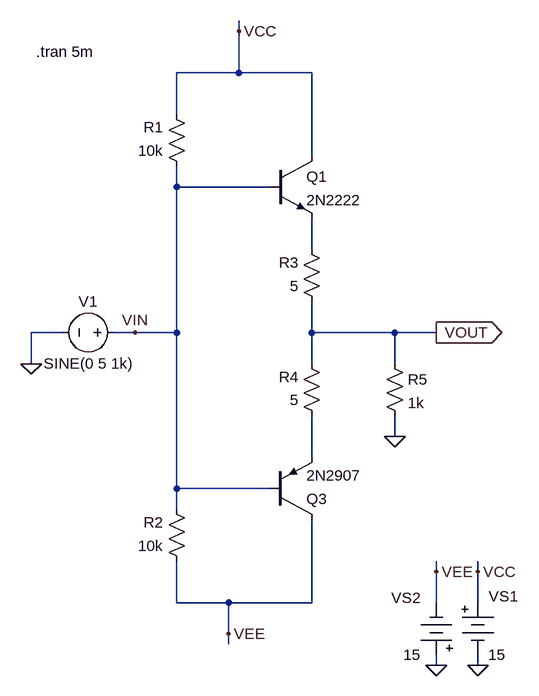
[diagram p0: schematic fig-02-06-20(b).asc]
fig-02-06-20(b).asc, the LTspice schematic file:
Version 4
SHEET 1 880 708
WIRE -192 -288 -192 -304
WIRE -192 -224 -192 -288
WIRE -192 -224 -288 -224
WIRE -80 -224 -192 -224
WIRE -288 -160 -288 -224
WIRE -80 -96 -80 -224
WIRE -288 -48 -288 -80
WIRE -144 -48 -288 -48
WIRE -80 48 -80 0
WIRE -464 176 -512 176
WIRE -352 176 -384 176
WIRE -288 176 -288 -48
WIRE -288 176 -352 176
WIRE -80 176 -80 128
WIRE 48 176 -80 176
WIRE 112 176 48 176
WIRE -512 224 -512 176
WIRE -80 224 -80 176
WIRE 48 224 48 176
WIRE 48 336 48 304
WIRE -80 368 -80 304
WIRE -288 416 -288 176
WIRE -144 416 -288 416
WIRE -288 448 -288 416
WIRE 112 544 112 528
WIRE 176 544 176 528
WIRE -288 592 -288 528
WIRE -208 592 -288 592
WIRE -80 592 -80 464
WIRE -80 592 -208 592
WIRE 112 592 112 544
WIRE 176 592 176 544
WIRE -208 640 -208 592
WIRE -208 656 -208 640
WIRE 112 688 112 672
WIRE 176 688 176 672
FLAG -512 224 0
FLAG 112 688 0
FLAG 176 688 0
FLAG 112 544 VEE
FLAG 176 544 VCC
FLAG -208 640 VEE
FLAG -192 -288 VCC
FLAG 112 176 VOUT
IOPIN 112 176 Out
FLAG 48 336 0
FLAG -352 176 VIN
SYMBOL Misc\\battery 176 576 R0
WINDOW 0 17 6 Left 2
WINDOW 3 16 96 Left 2
SYMATTR InstName VS1
SYMATTR Value 15
SYMBOL Misc\\battery 112 688 R180
WINDOW 0 24 104 Left 2
WINDOW 3 24 16 Left 2
SYMATTR InstName VS2
SYMATTR Value 15
SYMBOL res -272 -64 R180
WINDOW 0 36 76 Left 2
WINDOW 3 36 40 Left 2
SYMATTR InstName R1
SYMATTR Value 10k
SYMBOL npn -144 -96 R0
SYMATTR InstName Q1
SYMATTR Value 2N2222
SYMBOL res -272 544 R180
WINDOW 0 36 76 Left 2
WINDOW 3 36 40 Left 2
SYMATTR InstName R2
SYMATTR Value 10k
SYMBOL voltage -368 176 R90
WINDOW 0 -32 56 VBottom 2
WINDOW 3 32 56 VTop 2
WINDOW 123 60 56 VTop 2
WINDOW 39 0 0 Left 0
SYMATTR InstName V1
SYMATTR Value SINE(0 5 1k)
SYMBOL pnp -144 464 M180
SYMATTR InstName Q3
SYMATTR Value 2N2907
SYMBOL res -64 144 R180
WINDOW 0 36 76 Left 2
WINDOW 3 36 40 Left 2
SYMATTR InstName R3
SYMATTR Value 5
SYMBOL res -64 320 R180
WINDOW 0 36 76 Left 2
WINDOW 3 36 40 Left 2
SYMATTR InstName R4
SYMATTR Value 5
SYMBOL res 32 208 R0
SYMATTR InstName R5
SYMATTR Value 1k
TEXT -504 -256 Left 2 !.tran 5m

The netlist it stands for:
* fig-02-06-20(b).asc
VS1 VCC 0 15
VS2 0 VEE 15
R1 VIN VCC 10k
Q1 VCC VIN N001 0 2N2222
R2 VEE VIN 10k
V1 VIN 0 SINE(0 5 1k)
Q3 VEE VIN N002 0 2N2907
R3 VOUT N001 5
R4 N002 VOUT 5
R5 VOUT 0 1k
.model NPN NPN
.model PNP PNP
.lib standard.bjt
.tran 5m
.backanno
.end